# EAGLE design 5Vboostlbi v1.1 (EAGLE 4.13)
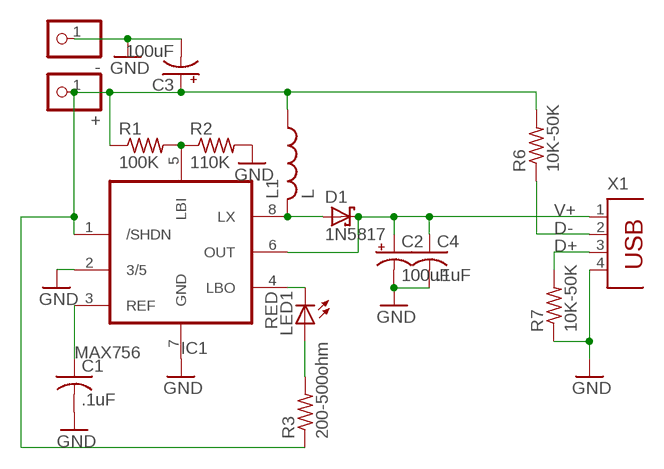
[diagram p0: schematic, sheet 1]

## Parts
+  PINHD-1X1  [1X01]
-  PINHD-1X1  [1X01]
C1  .1uF  C-US025-024X044  [C025-024X044]
C2  100uF  CPOL-USE2.5-5  [E2,5-5]
C3  100uF  CPOL-USE2.5-5  [E2,5-5]
C4  .1uF  C-US025-024X044  [C025-024X044]
D1  1N5817  SCHOTTKY-DIODEDO41  [DO41-10]
IC1  MAX756  MAX756CPA  [DIL08]
L1  L  [6000]
LED1  RED  LEDSMT1206  [1206]
R1  100K  R-US_M1206  [M1206]
R2  110K  R-US_M1206  [M1206]
R3  200-500ohm  R-US_M1206  [M1206]
R6  10K-50K  R-US_0207/2V  [0207/2V]
R7  10K-50K  R-US_0207/2V  [0207/2V]
X1  PN87520  [PN87520]

## Nets
D+: R7.2 X1.3
D-: R6.1 X1.2
GND: -.1 C1.2 C2.- C3.- C4.2 IC1.2(3/5) IC1.7(GND) R2.2 R7.1 X1.4
N$1: C1.1 IC1.3(REF)
N$2: +.1 C3.+ IC1.1(/SHDN) L1.1 R1.1 R3.1 R6.2
N$5: D1.A IC1.8(LX) L1.2
N$6: IC1.4(LBO) LED1.C
N$9: IC1.5(LBI) R1.2 R2.1
N$10: LED1.A R3.2
V+: C2.+ C4.1 D1.C IC1.6(OUT) X1.1

## Library data of the parts
+ - = pinhead-ez:PINHD-1X1: PIN HEADER
C1 C4 = rcl-ez:C-US: CAPACITOR, American symbol
C2 C3 = rcl-ez:CPOL-US: POLARIZED CAPACITOR, American symbol
D1 = usbbuck:SCHOTTKY-DIODE: Schottky Diode
IC1 = usbbuck:MAX756
L1 = usbbuck:L
LED1 = led:LED: LED OSRAM: - CHIPLED LG R971, LG N971, LY N971, LG Q971, LY Q971, LO R971, LY R971 LH N974, LH R974 LS Q976, LO Q976, LY Q976 LO Q996 - Hyper CHIPLED LW Q18S LB Q993, LB Q99A, LB R99A - SideLED LS A670, LO A670, LY A670, LG A670, LP A670 LB A673, LV A673, LT A673, LW A673 LH A674 LY A675 LS A676, LA A676, LO A676, LY A676, LW A676 LS A679, LY A679, LG A679 - Hyper Micro SIDELED® LS Y876, LA Y876, LO Y876, LY Y876 LT Y87S - SmartLED LW L88C, LW L88S LB L89C, LB L89S, LG L890 LS L89K, LO L89K, LY L89K LS L896, LA L896, LO L896, LY L896 - TOPLED LS T670, LO T670, LY T670, LG T670, LP T670 LSG T670, LSP T670, LSY T670, LOP T670, LYG T670 LG T671, LOG T671, LSG T671 LB T673, LV T673, LT T673, LW T673 LH T674 LS T676, LA T676, LO T676, LY T676, LB T676, LH T676, LSB T676, LW T676 LB T67C, LV T67C, LT T67C, LS T67K, LO T67K, LY T67K, LW E67C LS E67B, LA E67B, LO E67B, LY E67B, LB E67C, LV E67C, LT E67C LW T67C LS T679, LY T679, LG T679 LS T770, LO T770, LY T770, LG T770, LP T770 LB T773, LV T773, LT T773, LW T773 LH T774 LS E675, LA E675, LY E675, LS T675 LS T776, LA T776, LO T776, LY T776, LB T776 LHGB T686 LT T68C, LB T68C - Hyper Mini TOPLED® LB M676 - Mini TOPLED Santana® LG M470 LS M47K, LO M47K, LY M47K Source: http://www.osram.convergy.de/
R1-R3 = rcl:R-US_: RESISTOR, American symbol
R6 R7 = rcl-ez:R-US_: RESISTOR, American symbol
X1 = con-berg:PN87520: BERG USB connector

## Board
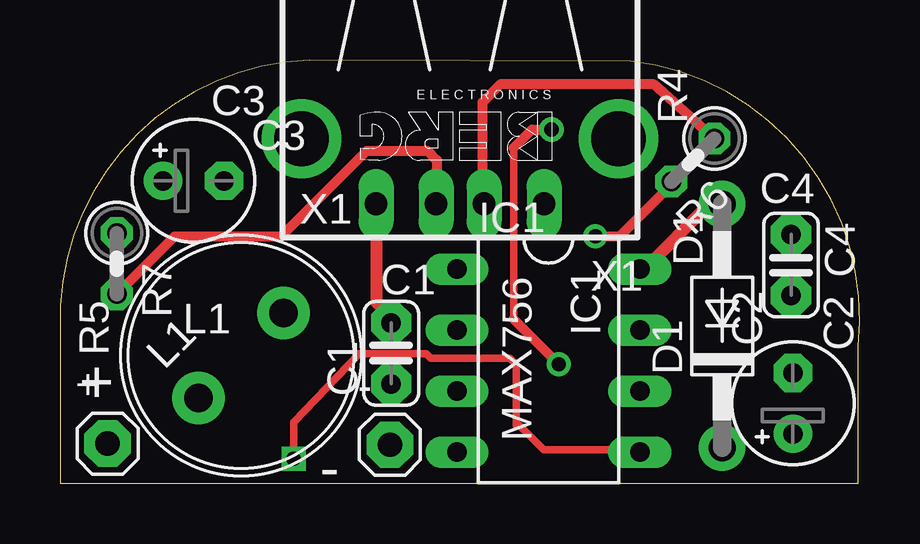
[diagram p1: board, top side]
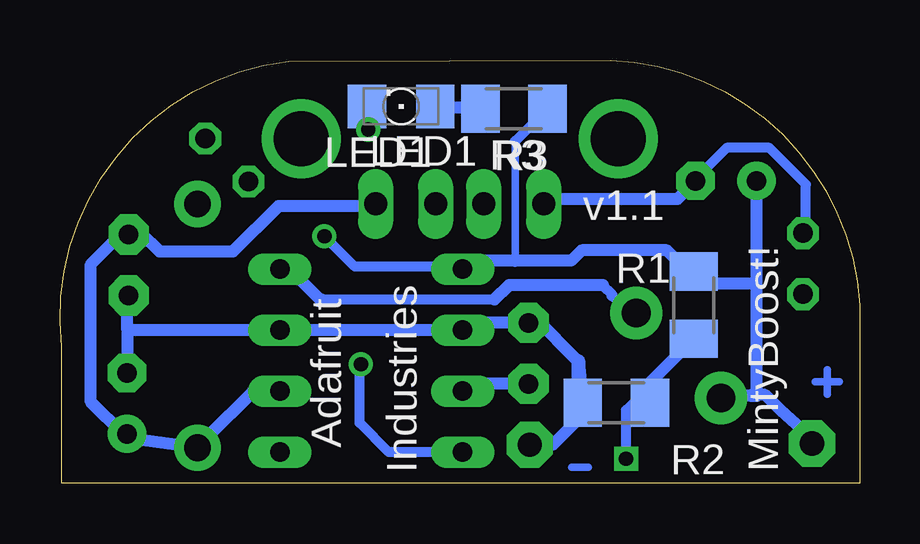
[diagram p2: board, bottom side, seen from below]

Size 33.32 x 17.63 mm. Coordinates in mm from the lower left corner, seen from the top.
Outline: 0,0 0,6.42 arc-90 10.38,17.63 23.79,17.58 arc-90 33.25,5.68 33.25,0
Outline: 0,0 33.25,0
Copper layers (1*16): Top 0.035mm / dielectric 1.5mm / Bottom 0.035mm
Design rules "default": minimum track width 12mil, minimum drill 23mil, track to track 10mil, track to pad 10mil, pad to pad 10mil, via to via 10mil, smd to smd 0mil, copper to edge 10mil, drill to drill 8mil, minimum pad ring 10mil, minimum via ring 8mil, stop-mask expansion 4mil, vias tented up to drill 0mil, thermal gap 10mil

### Footprints (pad centres in the part's own frame; a part is rotated, then mirrored left to right if it is on the bottom)
1X01 = drill 1.016 pad 1.93 octagon: 1 0,0
C025-024X044 = drill 0.813 pad 1.676 octagon: 1 -1.27,0; 2 1.27,0
E2,5-5 = drill 0.813 pad 1.6 round: + -1.27,0 | drill 0.813 pad 1.6 octagon: - 1.27,0
DO41-10 = drill 1.118 pad 1.93 round: A 5.08,0; C -5.08,0
DIL08 = drill 0.813 long: 1 -3.81,-3.81; 2 -1.27,-3.81; 3 1.27,-3.81; 4 3.81,-3.81; 5 3.81,3.81; 6 1.27,3.81; 7 -1.27,3.81; 8 -3.81,3.81
6000 = drill 1.2 pad 2.184 round: 1 -2.5,0; 2 2.5,0
1206 = smd 1.6 x 1.803: A -1.422,0; C 1.422,0
M1206 = smd 1.6 x 2: 1 -1.4,0; 2 1.4,0
0207/2V = drill 0.813 octagon: 1 -1.27,0; 2 1.27,0
PN87520 = drill 0.95 long: 1 -3.5,2.71; 2 -1,2.71; 3 1,2.71; 4 3.5,2.71 | drill 2.286 round: P$1 -6.604,0; P$2 6.604,0

### Placement (x,y rotation side)
+  1.99,1.65 0 top
-  13.75,1.6 0 top
C1  13.8,5.41 90 top
C2  30.54,3.33 90 top
C3  5.57,12.6 0 top
C4  30.46,9.1 270 top
D1  27.59,6.56 90 top
IC1  20.35,5.11 270 top
L1  7.54,5.32 45 top
LED1  19.11,15.7 180 bottom
R1  6.91,7.42 270 bottom
R2  10.14,3.36 180 bottom
R3  14.41,15.6 180 bottom
R6  26.37,13.46 225 top
R7  2.37,9.15 270 top
X1  16.67,14.35 180 top

### Tracks (layer width: path | path; a pad name or v marks a point on that pad's centre or on a via)
D+
  Top 0.406: R7.2 4.78,10.29 9.22,10.29 12.78,13.85 15.32,13.85 15.7,13.46 15.7,11.68 X1.3
D-
  Top 0.406: R6.1 24.72,16.64 18.37,16.64 17.61,15.88 17.61,11.7 X1.2
GND
  Top 0.508: C1.2 13.92,6.79 13.17,7.54 X1.4
  Bottom 0.406: C3.- 6.84,12.68 5.54,13.97 3.76,13.97 2.24,12.45 2.24,10.29 R7.1
  Bottom 0.508: -.1 12.78,1.6 11.76,2.62 11.76,5.11 | 11.76,5.11 13.54,6.89 13.75,6.68 C1.2 16.13,6.68 16.44,6.38 IC1.2 IC1.7 30.51,6.38 | X1.4 12.97,11.84 7.6,11.84 C3.- | 30.54,4.8 C2.- 30.51,4.63 30.51,6.38 | C4.2 30.31,7.6 30.51,7.34 30.51,6.38 | 11.76,5.11 11.69,5.11 11.69,4.86 R2.2
N$1
  Bottom 0.508: IC1.3 16.41,3.84 16.34,3.76 15.96,4.14 C1.1
N$2  (via drill 0.6)
  Top 0.406: R6.2 25.47,12.46 25.48,12.45 23.32,10.29 v22.31,10.29
  Bottom 0.305: 14.36,9.27 14.36,14.25
  Bottom 0.406: 14.36,9.27 14.36,9.22 | 14.36,14.25 R3.1 | 16.67,8.84 16.84,9.02 21.04,9.02 v22.31,10.29
  Bottom 0.508: 4.3,8.31 4.3,3.63 4.53,3.63 | 4.3,8.31 C3.+ | +.1 1.99,1.86 3.29,3.03 3.94,3.69 4.53,3.69 4.53,3.63 | IC1.1 16.67,8.84 16.59,8.77 16.08,9.27 14.36,9.27 12.02,9.27 11.59,9.71 8.03,9.71 6.64,8.31 R1.1 6.53,8.31 4.3,8.31 | L1.1 6.18,3.43 6.18,3.63 4.53,3.63
N$4
  Bottom 0.305: 0.84,4.22 1.86,4.22
N$5
  Top 0.508: IC1.8 24.36,8.92 27.08,11.64 D1.A
  Bottom 0.406: 15.22,7.65 22.43,7.65 | L1.2 10.34,7.8 10.29,7.85 10.7,8.26
  Bottom 0.508: 24.29,8.94 IC1.8 23.75,8.92 22.48,7.65 22.43,7.65 | 15.22,7.65 14.61,8.26 10.7,8.26
N$6  (via drill 0.6)
  Top 0.305: 18.9,6.84 18.9,13.97
  Top 0.406: v20.78,4.96 18.9,6.84 | 18.9,13.97 19.66,14.73 v20.48,14.73
  Bottom 0.406: IC1.4 19.61,1.3 20.83,2.52 20.83,5.16 v20.78,4.96 | LED1.C 20.5,15.67 20.35,15.67 20.35,14.86 v20.48,14.73
N$7
  Bottom 0.305: 1.35,3.71 1.35,4.73
N$8
  Bottom 0.305: 11.99,0.66 11.31,0.66
N$9  (via drill 0.6)
  Top 0.305: IC1.5 24.19,1.4 20.15,1.4 19.13,2.42 19,2.42 19,4.96 18.75,5.21 15.45,5.21 15.27,5.39 12.48,5.39 9.73,2.54 v9.73,1.02
  Bottom 0.305: 9.7,2.42 9.73,2.42 9.73,1.15
  Bottom 0.406: v9.73,1.02 9.73,1.15 9.73,3.04 8.94,3.83
  Bottom 0.508: 8.94,3.83 R2.1 8.84,3.76 | 8.84,3.76 8.84,3.69 | R1.2 8.84,4.09 8.84,3.76
N$10
  Bottom 0.508: R3.2 15.86,15.65 17.63,15.65 LED1.A
V+
  Bottom 0.508: C2.+ 30.64,2.16 | C2.+ 30.33,1.86 D1.C 27.21,1.91 25.28,3.84 IC1.6 | X1.1 20.15,11.62 20.15,11.56 24.21,11.56 26.12,9.65 29.16,9.65 29.93,10.42 29.98,10.37 C4.1 30.79,10.37 32.03,9.12 32.03,3.38 30.69,2.03 30.66,2.06 C2.+

### Text on the board
tPlace: C3 | R4 | C4 | X1 | D1 | R5 | L1 | C1 | IC1 | C2 | + | MAX756 | -
bPlace: R3 | LED1 | v1.1 | R1 | R2 | Adafruit | MintyBoost! | Industries